# EAGLE design LCD_ctrl_v2b (EAGLE 6.4)
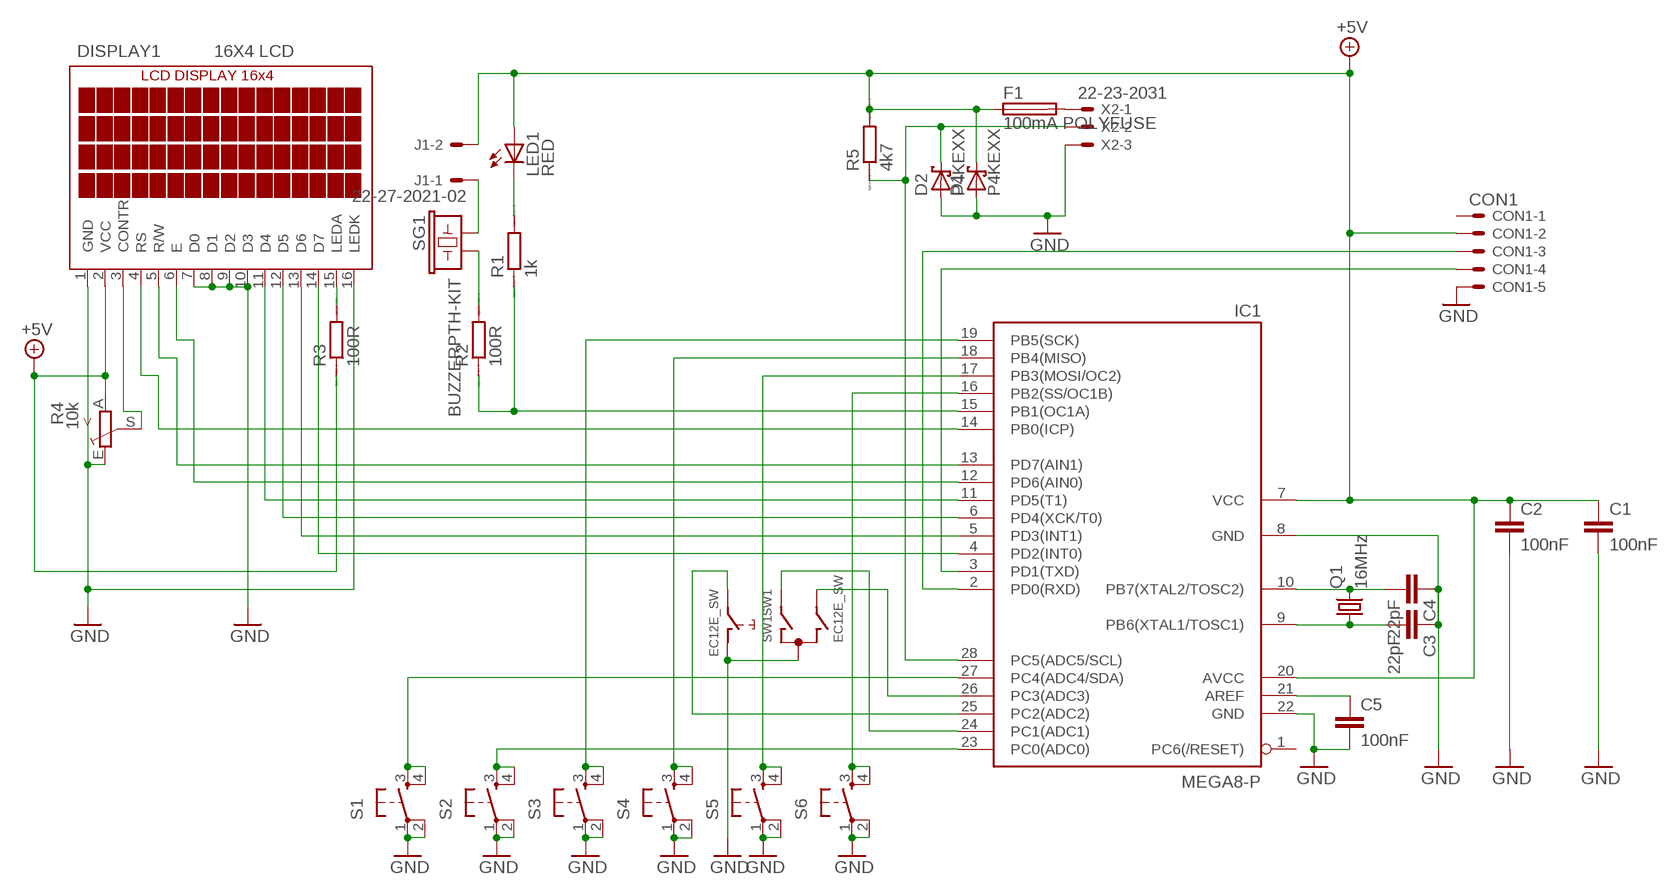
[diagram p0: schematic, sheet 1]

## Parts
C1  100nF  C-EU050-025X075  [C050-025X075]
C2  100nF  C-EU050-025X075  [C050-025X075]
C3  22pF  C-EU050-025X075  [C050-025X075]
C4  22pF  C-EU050-025X075  [C050-025X075]
C5  100nF  C-EU050-025X075  [C050-025X075]
CON1  CON1  22-23-2051  [22-23-2051]
D1  P4KEXX  [DO41-10]
D2  P4KEXX  [DO41-10]
DISPLAY1  16X4 LCD  LCD-AC-1604A_BIG_PADS  [LCD-AC-1604A-BIG_PADS]
F1  100mA POLYFUSE  TE5  [TE5]
IC1  MEGA8-P  [DIL28-3]
J1  22-27-2021-02  [6410-02]
LED1  RED  TLLR4400  [LED3MM]
Q1  16MHz  CRYSTALHC49S  [HC49/S]
R1  1k  R0204/7  [0204/7]
R2  100R  R0204/7  [0204/7]
R3  100R  R0204/7  [0204/7]
R4  10k  TRIM_EU-CA6H  [CA6H]
R5  4k7  R0204/7  [0204/7]
S1  TAC_SWITCHPTH  [TACTILE-PTHX]
S2  TAC_SWITCHPTH  [TACTILE-PTHX]
S3  TAC_SWITCHPTH  [TACTILE-PTHX]
S4  TAC_SWITCHPTH  [TACTILE-PTHX]
S5  TAC_SWITCHPTH  [TACTILE-PTHX]
S6  TAC_SWITCHPTH  [TACTILE-PTHX]
SG1  BUZZERPTH-KIT  [BUZZER-12MM-KIT]
SW1  EC12E_SW  [ALPS_EC12E_SW]
X2  22-23-2031  [22-23-2031]

## Nets
+5V: C1.1 C2.1 CON1.2 D1.C DISPLAY1.2(VCC) F1.1 IC1.7(VCC) IC1.20(AVCC) J1.2 LED1.A R3.1 R4.A R5.2
GND: C1.2 C2.2 C3.1 C4.1 C5.2 CON1.5 D1.A D2.A DISPLAY1.1(GND) DISPLAY1.7(D0) DISPLAY1.8(D1) DISPLAY1.9(D2) DISPLAY1.10(D3) DISPLAY1.16(LEDK) IC1.8(GND) IC1.22(GND) R4.E S1.1 S1.2 S2.1 S2.2 S3.1 S3.2 S4.1 S4.2 S5.1 S5.2 S6.1 S6.2 SW1.C SW1.D X2.3
N$1: C5.1 IC1.21(AREF)
N$2: F1.2 X2.1
N$3: C4.2 IC1.10(PB7(XTAL2/TOSC2)) Q1.2
N$4: C3.2 IC1.9(PB6(XTAL1/TOSC1)) Q1.1
N$5: CON1.4 IC1.3(PD1(TXD))
N$6: CON1.3 IC1.2(PD0(RXD))
N$7: DISPLAY1.14(D7) IC1.4(PD2(INT0))
N$8: DISPLAY1.13(D6) IC1.5(PD3(INT1))
N$9: DISPLAY1.12(D5) IC1.6(PD4(XCK/T0))
N$10: DISPLAY1.11(D4) IC1.11(PD5(T1))
N$11: IC1.23(PC0(ADC0)) S2.3 S2.4
N$12: DISPLAY1.3(CONTR) R4.S
N$13: R2.2 SG1.-
N$15: DISPLAY1.6(E) IC1.12(PD6(AIN0))
N$16: DISPLAY1.5(R/W) IC1.13(PD7(AIN1))
N$17: LED1.K(C) R1.2
N$18: DISPLAY1.4(RS) IC1.14(PB0(ICP))
N$19: IC1.19(PB5(SCK)) S3.3 S3.4
N$20: IC1.18(PB4(MISO)) S4.3 S4.4
N$21: IC1.17(PB3(MOSI/OC2)) S5.3 S5.4
N$22: IC1.16(PB2(SS/OC1B)) S6.3 S6.4
N$23: IC1.24(PC1(ADC1)) SW1.A
N$24: J1.1 SG1.+
N$25: DISPLAY1.15(LEDA) R3.2
N$26: IC1.25(PC2(ADC2)) SW1.E
N$27: IC1.26(PC3(ADC3)) SW1.B
N$28: IC1.27(PC4(ADC4/SDA)) S1.3 S1.4
N$29: D2.C IC1.28(PC5(ADC5/SCL)) R5.1 X2.2
N$30: IC1.15(PB1(OC1A)) R1.1 R2.1
Unconnected: CON1.1 IC1.1(PC6(/RESET)) SW1.GND1(G) SW1.GND2(G)

## Library data of the parts
C1-C5 = rcl:C-EU: CAPACITOR, European symbol
CON1 = con-molex:22-23-2051: .100" (2.54mm) Center Header - 5 Pin; MF: MOLEX; MPN: 22-23-2051; OC_FARNELL: 1462952; OC_NEWARK: 38C9178
D1 D2 = diode:P4KEXX: DIODE transient-voltage suppressor
DISPLAY1 = AV-Display:LCD-AC-1604A_BIG_PADS: LCD display 16x4 characters with blue backlight, negative blue http://www.artronic.com.pl/o_produkcie.php?id=629?
F1 = fuse:TE5: FUSE Wickmann; OC_FARNELL: unknown; OC_NEWARK: unknown
IC1 = atmel:MEGA8-P: MICROCONTROLLER 8 Kbytes FLASH, 1 kbytes SRAM, 512 bytes EEPROM, USART, 4-channel 10 bit ADC, 2-channel 8 bit ADC Pin compatible with Atmega48, ATMega88, ATMega168 Source: avr.lbr; OC_FARNELL: unknown; OC_NEWARK: unknown
J1 = con-molex:22-?-02: CONNECTOR wire to board 2.54 mm (.1 inch) pitch header; OC_FARNELL: unknown; OC_NEWARK: unknown
LED1 = led:TLLR4400: Low Current (2mA) LED 3 mm Tinted Diffused Package color RED Source: Data sheet <http://www.farnell.com/datasheets/391100.pdf>; MF: VISHAY SEMICONDUCTOR; OC_FARNELL: 1612437
Q1 = crystal:CRYSTAL: CRYSTAL; OC_FARNELL: 1667008; OC_NEWARK: unknown
R1-R3 R5 = eagle-ltspice:R: RESISTOR, European symbol; SPICEMODEL: NONE; SPICEPREFIX: R
R4 = pot:TRIM_EU-: POTENTIOMETER
S1-S6 = SparkFun-Electromechanical:TAC_SWITCH: Momentary Switch Button commonly used for reset or general input. Spark Fun Electronics SKU : COM-00097 SMT- SWCH-08247
SG1 = SparkFun-Electromechanical:BUZZER: Buzzer 12mm Spark Fun Electronics SKU : Comp-Buzzer; PROD_ID: COMP-08253
SW1 = switch-alps:EC12E_SW: ALPS rotary Encoder EC12E series with switch; MPN: EC12E2424407; OC_FARNELL: 1520813; OC_NEWARK: 74M1068
X2 = con-molex:22-23-2031: .100" (2.54mm) Center Header - 3 Pin; MF: MOLEX; MPN: 22-23-2031; OC_FARNELL: 1462950; OC_NEWARK: 30C0862

## Board
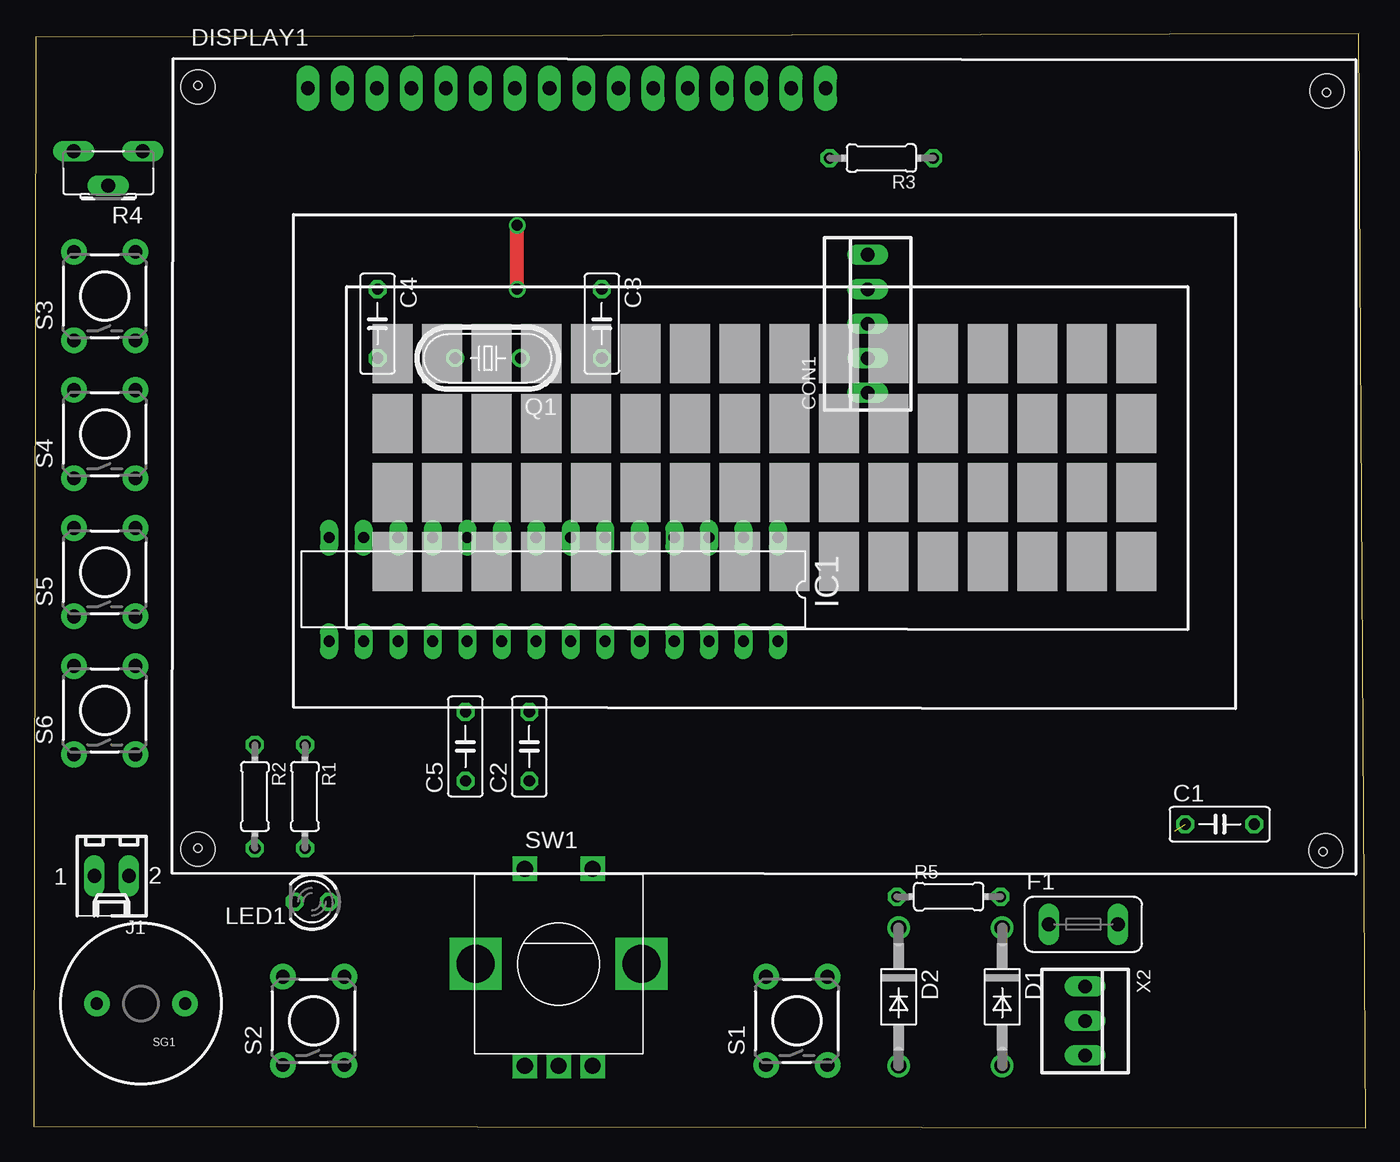
[diagram p1: board, top side]
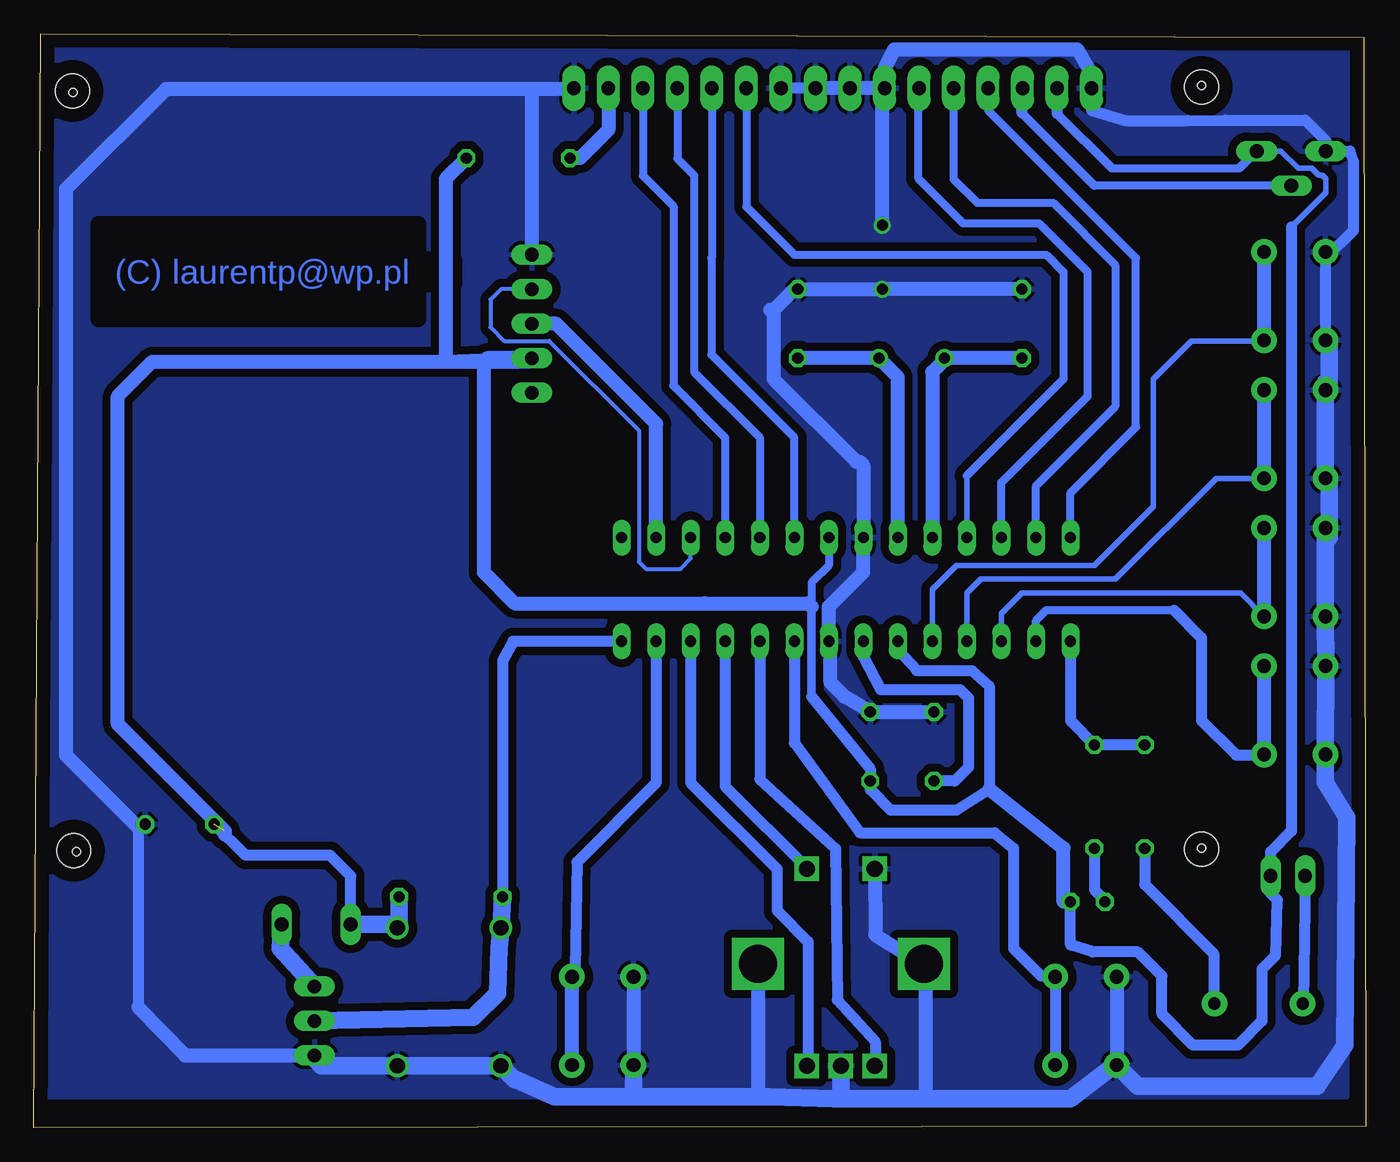
[diagram p2: board, bottom side, seen from below]

Size 97.98 x 80.5 mm. Coordinates in mm from the lower left corner, seen from the top.
Outline: 0,0.12 97.98,0 97.48,80.5 0.13,80.25 0,0.12
Copper layers (1*16): Top 0.035mm / dielectric 1.5mm / Bottom 0.035mm
Design rules "default": minimum track width 10mil, minimum drill 24mil, track to track 8mil, track to pad 8mil, pad to pad 8mil, via to via 8mil, smd to smd 8mil, copper to edge 40mil, drill to drill 8mil, minimum pad ring 10mil, minimum via ring 8mil, stop-mask expansion 4mil, vias tented up to drill 0mil, thermal gap 10mil
Holes 0.6 mm at 95.12,76.2 94.87,20.32 12.06,20.57 12.06,76.7
bRestrict: area 69.7,59.5 to 93.2,66.5

### Footprints (pad centres in the part's own frame; a part is rotated, then mirrored left to right if it is on the bottom)
C050-025X075 = drill 0.813 octagon: 1 -2.54,0; 2 2.54,0
22-23-2051 = drill 1 long: 1 -5.08,0; 2 -2.54,0; 3 0,0; 4 2.54,0; 5 5.08,0
DO41-10 = drill 1.118: A 5.08,0; C -5.08,0
LCD-AC-1604A-BIG_PADS = drill 1 pad 1.676 long: 1 -29.5,15.3; 2 -26.96,15.3; 3 -24.42,15.3; 4 -21.88,15.3; 5 -19.34,15.3; 6 -16.8,15.3; 7 -14.26,15.3; 8 -11.72,15.3; 9 -9.18,15.3; 10 -6.64,15.3; 11 -4.1,15.3; 12 -1.56,15.3; 13 0.98,15.3; 14 3.52,15.3; 15 6.06,15.3; 16 8.6,15.3 | hole 2.5: -37.6,-40.7; -37.6,15.4; 45.5,15.1; 45.4,-40.8
TE5 = drill 1.016 long: 1 -2.54,0; 2 2.54,0
DIL28-3 = drill 0.813 long: 1 -16.51,-3.81; 2 -13.97,-3.81; 3 -11.43,-3.81; 4 -8.89,-3.81; 5 -6.35,-3.81; 6 -3.81,-3.81; 7 -1.27,-3.81; 8 1.27,-3.81; 9 3.81,-3.81; 10 6.35,-3.81; 11 8.89,-3.81; 12 11.43,-3.81; 13 13.97,-3.81; 14 16.51,-3.81; 15 16.51,3.81; 16 13.97,3.81; 17 11.43,3.81; 18 8.89,3.81; 19 6.35,3.81; 20 3.81,3.81; 21 1.27,3.81; 22 -1.27,3.81; 23 -3.81,3.81; 24 -6.35,3.81; 25 -8.89,3.81; 26 -11.43,3.81; 27 -13.97,3.81; 28 -16.51,3.81
6410-02 = drill 1.016 long: 1 1.27,0; 2 -1.27,0
LED3MM = drill 0.813 octagon: A -1.27,0; K 1.27,0
HC49U-V = drill 0.813: 1 -2.413,0; 2 2.413,0
0204/7 = drill 0.813 octagon: 1 -3.81,0; 2 3.81,0
CA6H = drill 1.016 long: A -2.54,0; E 2.54,0; S 0,2.54
TACTILE-PTHX = drill 1.016 pad 1.88: 1 -3.251,2.261; 2 3.251,2.261; 3 -3.251,-2.261; 4 3.251,-2.261
BUZZER-12MM-KIT = drill 0.9 pad 1.88: + 3.25,0; - -3.25,0
ALPS_EC12E_SW = drill 1.2 square: A -2.5,-7.5; B 2.5,-7.5; C 0,-7.5; D -2.5,7; E 2.5,7 | drill 2.8 square: GND1 -6.1,0; GND2 6.1,0
22-23-2031 = drill 1 long: 1 -2.54,0; 2 0,0; 3 2.54,0

### Placement (x,y rotation side)
C1  87.25,22.35 0 top
C2  36.45,28.06 90 top
C3  41.78,59.18 270 top
C4  25.27,59.18 270 top
C5  31.75,28.06 90 top
CON1  61.34,59.18 90 top
D1  71.25,9.65 270 top
D2  63.63,9.65 270 top
DISPLAY1  49.66,61.21 0 top
F1  77.22,14.98 0 top
IC1  38.23,39.62 180 top
J1  5.71,18.54 180 top
LED1  20.45,16.63 180 top
Q1  16MHz  [HC49U-V]  33.4,56.64 180 top
R1  19.94,24.38 270 top
R2  16.26,24.38 270 top
R3  62.36,71.37 180 top
R4  5.46,71.88 180 top
R5  67.31,17.01 0 top
S1  56.13,7.87 90 top
S2  20.57,7.87 90 top
S3  5.21,61.21 90 top
S4  5.21,51.05 90 top
S5  5.21,40.89 90 top
S6  5.21,30.73 90 top
SG1  7.87,9.14 180 top
SW1  38.61,12.06 0 top
X2  77.34,7.87 270 top

### Tracks (layer width: path | path; a pad name or v marks a point on that pad's centre or on a via)
+5V  (1 unrouted)
  Bottom 0.406: 22.23,16.63 LED1.A | 48.39,38.86 48.64,38.6 | R4.A 6.22,71.88 4.95,70.61 3.94,70.61 3.43,70.1 3.17,70.1 2.92,69.85 2.92,68.83 5.46,66.29 | IC1.20 34.42,35.17
  Bottom 0.6: IC1.7 39.5,41.4 40.77,40.13 40.77,38.35 | 18.67,70.61 9.27,70.61
  Bottom 0.61: 40.77,38.35 40.77,31.75 | 22.7,74.64 18.67,70.61 | 9.27,70.61 R4.A
  Bottom 0.8: DISPLAY1.2 22.7,74.64
  Bottom 0.813: LED1.A 21.72,13.46 20.07,12.95 16.76,12.95 14.99,11.17 14.99,8.38 12.7,6.09 9.4,6.09 7.62,7.87 7.62,11.68 6.6,12.7 6.48,16.76 6.98,17.27 J1.2 6.98,20.32 5.46,21.84 5.46,66.29 | F1.1 74.68,18.54 76.2,20.06 82.42,20.06 C1.1 | 40.77,31.75 36.45,26.41 C2.1 36.45,24.89 34.93,23.36 30.1,23.36 27.69,24.89 27.69,32.51 28.96,33.65 33.02,33.65 34.42,35.17
  Bottom 1.016: R3.1 67.69,69.85 67.69,56.38 | 67.69,56.38 CON1.2 | 83.95,21.59 83.95,21.84 91.82,29.71 91.82,53.84 89.28,56.38 67.69,56.38 | 67.69,56.38 64.9,56.38 | 64.9,56.38 61.59,56.38 CON1.2 | CON1.2 64.64,56.64 64.9,56.38 | 64.9,56.38 64.9,40.89 62.61,38.6 48.64,38.6 41.02,38.6 40.77,38.35 | 22.23,16.63 22.23,20.57 27.69,24.89
  Bottom 1.27: R5.2 71.12,15.24 | 71.12,15.24 D1.C | F1.1 71.37,14.98 71.12,15.24
GND  (via drill 0.8)
  Top 1.016: v35.56,61.72 v35.56,66.42
  Bottom 0.406: 58.29,76.7 58.04,76.7 | 43.82,60.45 43.56,60.19
  Bottom 0.813: DISPLAY1.1 20.16,74.89 17.65,74.13 13.07,74.13 10.29,74.16 4.45,74.16 2.92,72.64 R4.E 1.14,71.88 0.89,71.12 0.89,66.04 1.65,65.27 2.74,64.26 S3.2 | 2.92,64.49 S3.2 | S3.2 S3.1 | 90.3,8.89 90.3,22.09 89.79,22.09 C1.2 | DISPLAY1.9 DISPLAY1.10
  Bottom 1.016: SW1.D 36.05,14.21 36.08,14.21 32.39,11.93 32.39,2.16 | 44.7,11.93 44.7,2.28 | 43.56,60.19 42.04,61.72 C3.1 v35.56,61.72 C4.1 | 43.56,60.19 43.56,55.11 37.47,49.02 37.21,49.02 36.96,48.76 IC1.8 36.96,40.89 39.5,38.35 IC1.22 39.37,35.68 39.37,32.76 38.35,31.75 C2.2 C5.2 | 43.56,60.19 43.82,60.19 | CON1.5 61.34,76.45 | 58.32,76.45 DISPLAY1.16 | 58.29,76.45 58.32,76.45 | 58.32,76.45 61.34,76.45 | 61.34,76.45 88.27,76.45 95.63,69.08 95.63,27.43 90.3,22.09 | 90.3,8.89 86.87,5.33 X2.3 | S1.2 S1.1 | S2.2 S2.1 | 43.05,76.55 DISPLAY1.10 | DISPLAY1.7 35.4,77.88 34.67,79.36 21.21,79.36 20.19,77.59 20.19,76.55 DISPLAY1.1 | DISPLAY1.7 DISPLAY1.8 DISPLAY1.9 | v35.56,66.42 35.56,76.35 DISPLAY1.7
  Bottom 1.27: S3.1 2.67,57.96 2.67,54.86 2.95,54.86 S4.1 2.67,47.8 2.67,43.43 2.95,43.43 S5.1 2.92,34.03 S6.1 2.95,25.42 1.4,22.86 1.52,6.09 3.56,3.04 16.74,3.04 S2.1 18.49,4.62 21.72,2.16 32.39,2.16 39.12,2.16 | 39.12,2.16 38.61,2.28 SW1.C | 53.85,2.28 44.7,2.28 43.94,2.28 39.12,2.16 | S1.1 53.87,2.31 53.85,2.28 | 53.85,2.28 59.69,2.28 62.48,3.55 62.61,3.55 D2.A | D1.A D2.A | X2.3 77.34,5.08 76.83,4.57 D2.A
  pour Bottom (isolate 0.6): 0.9,80.23 97.42,80.23 97.92,2.28 1.4,2.28
N$1
  Bottom 0.406: IC1.21 36.96,34.67
  Bottom 0.813: 36.96,34.67 35.69,32.25 29.84,32.25 29.21,31.62 29.21,26.54 30.23,25.52 C5.1
N$2
  Bottom 1.27: X2.1 79.88,13.2 F1.2
N$3
  Bottom 1.016: C4.2 Q1.2 30.99,56.51 31.88,55.62 IC1.10
N$4
  Bottom 1.016: IC1.9 34.42,55.24 Q1.1 C3.2
N$5
  Bottom 0.305: CON1.4 63.63,61.72 64.39,60.96 64.39,58.92 63.37,57.91 60.07,57.91 53.47,51.3 53.47,41.65 52.96,41.14 50.42,41.14 49.66,41.91 IC1.3
N$6
  Bottom 1.016: IC1.2 52.2,51.81 59.56,59.18 CON1.3
N$7
  Bottom 0.6: DISPLAY1.14 53.18,70.06 50.93,67.81 50.93,54.61 47.12,50.8 IC1.4
N$8
  Bottom 0.6: DISPLAY1.13 50.64,71.33 49.4,70.1 49.4,55.62 44.58,50.8 IC1.5
N$9
  Bottom 0.406: 48.1,64.04 48.13,64
  Bottom 0.6: DISPLAY1.12 48.1,64.04 | 48.13,64 48.13,56.89 42.04,50.8 IC1.6
N$10
  Bottom 0.406: 29.34,48 IC1.11
  Bottom 0.6: DISPLAY1.11 45.56,67.78 42.04,64.26 23.49,64.26 22.23,62.99 22.23,55.11 29.34,48
N$11
  Bottom 0.813: IC1.23 42.04,28.32 37.21,21.71 27.3,21.71 25.91,20.57 25.91,13.2 23.88,11.17 22.88,11.17 S2.4 S2.3
N$12
  Bottom 0.406: 25.27,76.47 DISPLAY1.3
  Bottom 0.6: R4.S 19.94,69.34
  Bottom 0.61: 19.94,69.34 25.27,74.67
  Bottom 0.8: 25.27,74.67 25.27,76.47
N$13
  Bottom 0.813: R2.2 16.26,17.9 11.18,12.82 11.18,9.19 SG1.-
N$14
  Bottom 1.27: 3.17,27.43 2.92,27.17
N$15
  Bottom 0.406: 32.89,76.47 DISPLAY1.6
  Bottom 0.6: IC1.12 26.8,47.49 20.45,53.84 20.45,62.99 24,66.54 29.59,66.54 32.89,69.85 32.89,76.47
N$16
  Bottom 0.6: DISPLAY1.5 30.32,69.81 28.58,68.07 22.99,68.07 18.41,63.5 18.41,53.08 24.26,47.24 IC1.13
N$17
  Bottom 0.406: 19.18,16.76 LED1.K
  Bottom 0.813: R1.2 19.94,17.52 19.18,16.76
N$18
  Bottom 0.406: DISPLAY1.4 27.78,74.89
  Bottom 0.6: IC1.14 21.72,46.73 16.89,51.56 16.89,64 27.78,74.89
N$19
  Bottom 0.406: IC1.19 31.88,39.62 30.1,41.4 19.94,41.4 15.62,45.72 15.62,55.11 12.83,57.91 7.52,57.91 S3.3
  Bottom 1.016: S3.4 S3.3
N$20
  Bottom 0.406: IC1.18 29.34,39.37 28.32,40.38 18.41,40.38 11,47.8 S4.3
  Bottom 1.016: S4.4 S4.3
N$21
  Bottom 0.406: IC1.17 26.8,37.84 25.27,39.37 9.2,39.37 S5.3
  Bottom 1.016: S5.4 S5.3
N$22
  Bottom 0.406: 7.52,27.43 S6.3
  Bottom 0.6: IC1.16 24.26,37.33 23.49,38.1 14.1,38.1
  Bottom 0.8: 14.1,38.1 12.06,36.06 12.06,29.97 9.53,27.43 7.52,27.43
  Bottom 1.016: S6.4 S6.3
N$23
  Bottom 0.406: 36.07,4.6 SW1.A
  Bottom 0.8: IC1.24 44.58,25.65 38.99,20.56 38.87,9.39 36.07,6.35 36.07,4.6
N$24
  Bottom 0.813: J1.1 4.57,9.19 SG1.+
N$25
  Bottom 1.016: DISPLAY1.15 55.72,73.44 57.79,71.37 R3.2
N$26
  Bottom 0.813: IC1.25 47.12,25.14 41.02,19.05 41.11,19.05 SW1.E
N$27
  Bottom 0.406: 41.02,4.6 SW1.B
  Bottom 0.8: IC1.26 49.66,25.4 43.31,19.05 43.31,15.99 41.02,13.7 41.02,4.6
N$28
  Bottom 0.406: 58.17,4.85 S1.3 | 58.17,11.68 58.4,11.68 S1.4
  Bottom 0.813: IC1.27 52.2,25.4 58.04,19.55 58.17,11.68
  Bottom 1.016: 58.17,4.85 58.4,4.85 S1.4
N$29
  Bottom 0.813: IC1.28 62.74,35.81 63.5,34.41 R5.1
  Bottom 1.27: R5.1 D2.C 63.75,13.2 63.88,9.9 65.66,8.12 X2.2
N$30
  Bottom 0.813: IC1.15 21.72,29.97 R1.1 R2.1

### Text on the board
Bottom: (C) laurentp@wp.pl